# EAGLE design atmega (EAGLE 8.6.0)
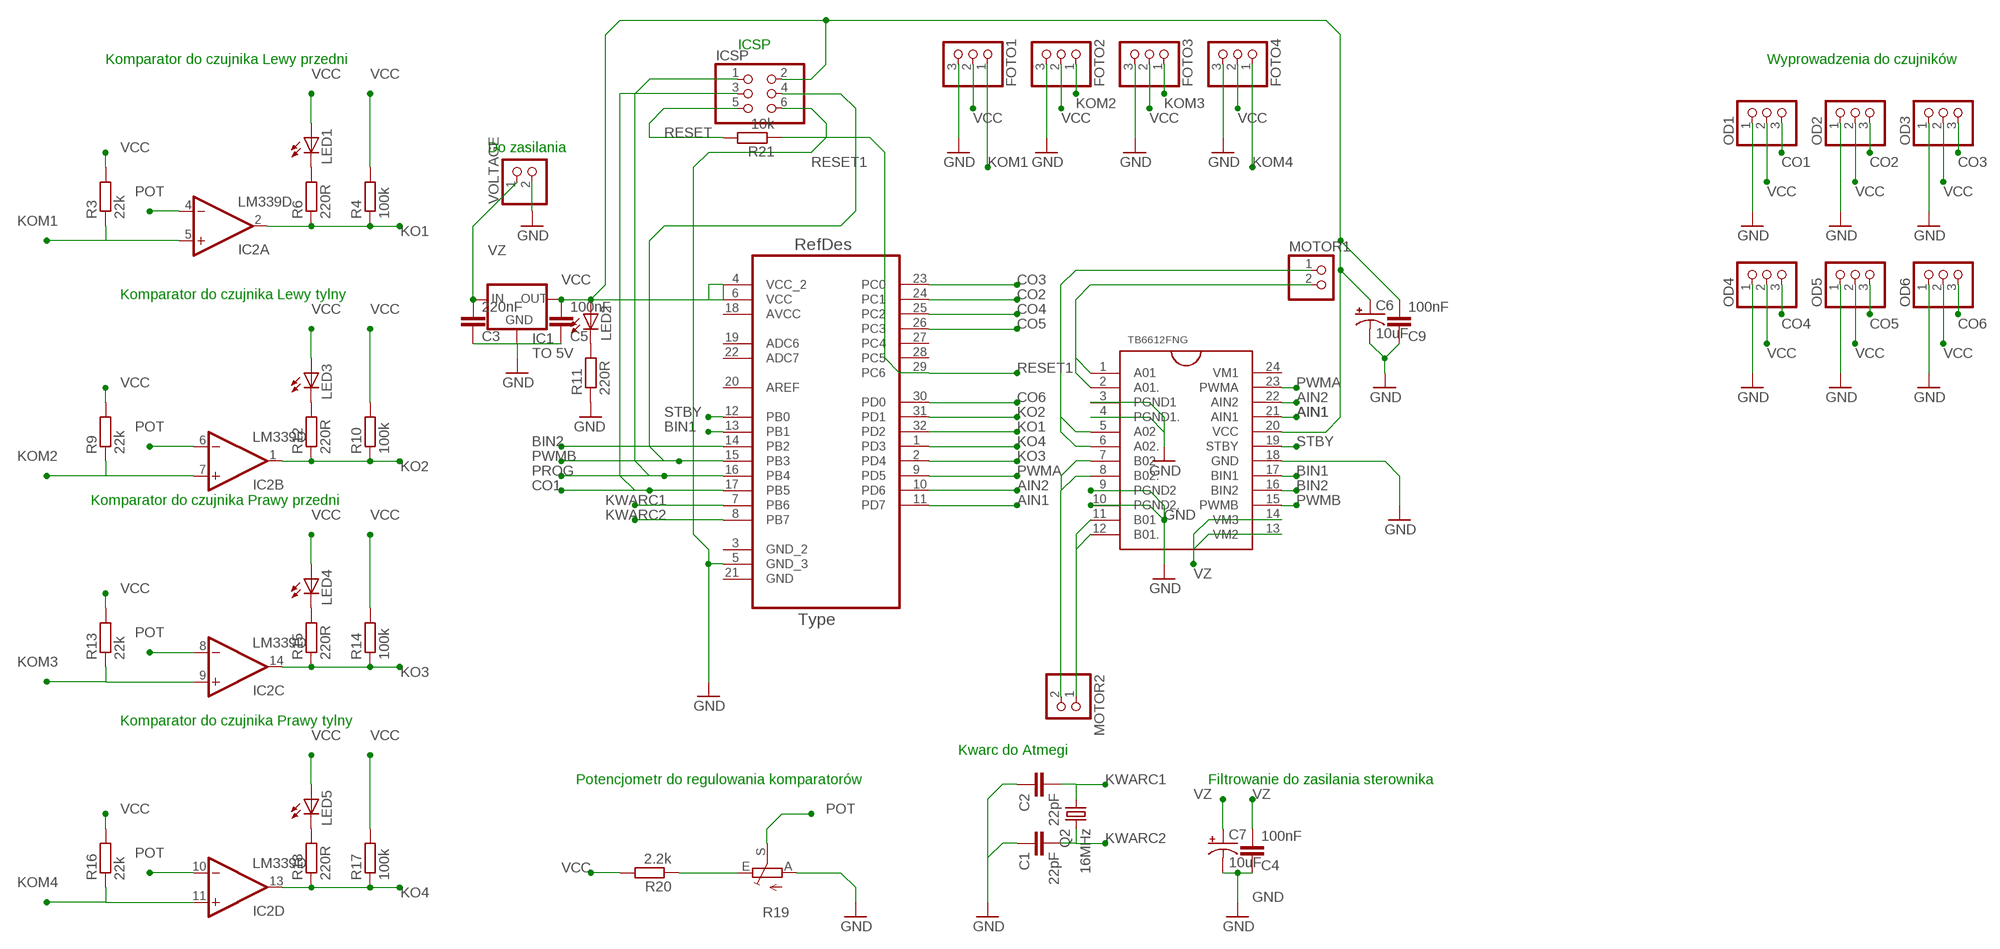
[diagram p0: schematic, sheet 1]

## Parts
C1  22pF  C-EUC0805  [C0805]
C2  22pF  C-EUC0805  [C0805]
C3  220nF  C-EUC0805  [C0805]
C4  100nF  C-EUC0805  [C0805]
C5  100nF  C-EUC0805  [C0805]
C6  10uF  22UF-POLAR-PANASONIC_C-35V-20%  [PANASONIC_C]
C7  10uF  22UF-POLAR-PANASONIC_C-35V-20%  [PANASONIC_C]
C9  100nF  C-EUC0805  [C0805]
FOTO1  PINHD-1X3  [1X03]
FOTO2  PINHD-1X3  [1X03]
FOTO3  PINHD-1X3  [1X03]
FOTO4  PINHD-1X3  [1X03]
IC1  TO 5V  LM1117T-5.0-V  [TO220V]
IC2  LM339D  [SO14]
ICSP  PINHD-2X3  [2X03]
LED1  LEDCHIPLED_0805  [CHIPLED_0805]
LED2  LEDCHIPLED_0805  [CHIPLED_0805]
LED3  LEDCHIPLED_0805  [CHIPLED_0805]
LED4  LEDCHIPLED_0805  [CHIPLED_0805]
LED5  LEDCHIPLED_0805  [CHIPLED_0805]
MOTOR1  PINHD-1X2  [1X02]
MOTOR2  PINHD-1X2  [1X02]
OD1  PINHD-1X3  [1X03]
OD2  PINHD-1X3  [1X03]
OD3  PINHD-1X3  [1X03]
OD4  PINHD-1X3  [1X03]
OD5  PINHD-1X3  [1X03]
OD6  PINHD-1X3  [1X03]
Q2  16MHz  CSM-7X-DU  [CSM-7X-DU]
R3  22k  R-EU_M0805  [M0805]
R4  100k  R-EU_M0805  [M0805]
R6  220R  R-EU_M0805  [M0805]
R9  22k  R-EU_M0805  [M0805]
R10  100k  R-EU_M0805  [M0805]
R11  220R  R-EU_M0805  [M0805]
R12  220R  R-EU_M0805  [M0805]
R13  22k  R-EU_M0805  [M0805]
R14  100k  R-EU_M0805  [M0805]
R15  220R  R-EU_M0805  [M0805]
R16  22k  R-EU_M0805  [M0805]
R17  100k  R-EU_M0805  [M0805]
R18  220R  R-EU_M0805  [M0805]
R19  TRIM_EU-B25P  [B25P]
R20  2.2k  R-EU_M0805  [M0805]
R21  10k  R-EU_M0805  [M0805]
U1  ATMEGA328P-AU  [QFP80P900X900X120-32N]
U$1  TB6612FNG  [SSOP24]
VOLTAGE  PINHD-1X2  [1X02]

## Nets
AIN1: U1.11(PD7) U$1.21(AIN1)
AIN2: U1.10(PD6) U$1.22(AIN2)
BIN1: U1.13(PB1) U$1.17(BIN1)
BIN2: U1.14(PB2) U$1.16(BIN2)
CO1: ICSP.3 OD1.3 U1.17(PB5)
CO2: OD2.3 U1.24(PC1)
CO3: OD3.3 U1.23(PC0)
CO4: OD4.3 U1.25(PC2)
CO5: OD5.3 U1.26(PC3)
CO6: OD6.3 U1.30(PD0)
GND: C1.1 C2.1 C3.1 C4.1 C5.1 C6.- C7.- C9.1 FOTO1.3 FOTO2.3 FOTO3.3 FOTO4.3 IC1.1(GND) ICSP.6 OD1.1 OD2.1 OD3.1 OD4.1 OD5.1 OD6.1 R11.1 R19.A U1.5(GND_3) U$1.3(PGND1) U$1.4(PGND1.) U$1.9(PGND2) U$1.10(PGND2.) U$1.18(GND) VOLTAGE.2
KO1: IC2.2(A:OUT) R4.1 R6.1 U1.32(PD2)
KO2: IC2.1(B:OUT) R10.1 R12.1 U1.31(PD1)
KO3: IC2.14(C:OUT) R14.1 R15.1 U1.2(PD4)
KO4: IC2.13(D:OUT) R17.1 R18.1 U1.1(PD3)
KOM1: FOTO1.1 IC2.5(A:+IN) R3.1
KOM2: FOTO2.1 IC2.7(B:+IN) R9.1
KOM3: FOTO3.1 IC2.9(C:+IN) R13.1
KOM4: FOTO4.1 IC2.11(D:+IN) R16.1
KWARC1: C2.2 Q2.1 U1.7(PB6)
KWARC2: C1.2 Q2.2 U1.8(PB7)
N$2: LED3.C R12.2
N$6: R19.E R20.1
N$7: LED2.C R11.2
N$20: LED1.C R6.2
N$21: LED4.C R15.2
N$29: LED5.C R18.2
OUTMA1: MOTOR1.2 U$1.1(A01) U$1.2(A01.)
OUTMA2: MOTOR1.1 U$1.5(A02) U$1.6(A02.)
OUTMB1: MOTOR2.1 U$1.11(B01) U$1.12(B01.)
OUTMB2: MOTOR2.2 U$1.7(B02) U$1.8(B02.)
POT: IC2.4(A:-IN) IC2.6(B:-IN) IC2.8(C:-IN) IC2.10(D:-IN) R19.S
PROG: ICSP.1 U1.16(PB4)
PWMA: U1.9(PD5) U$1.23(PWMA)
PWMB: ICSP.4 U1.15(PB3) U$1.15(PWMB)
RESET: ICSP.5 R21.2
RESET1: R21.1 U1.29(PC6)
STBY: U1.12(PB0) U$1.19(STBY)
VCC: C5.2 C6.+ C9.2 FOTO1.2 FOTO2.2 FOTO3.2 FOTO4.2 IC1.2(OUT) ICSP.2 LED1.A LED2.A LED3.A LED4.A LED5.A OD1.2 OD2.2 OD3.2 OD4.2 OD5.2 OD6.2 R3.2 R4.2 R9.2 R10.2 R13.2 R14.2 R16.2 R17.2 R20.2 U1.4(VCC_2) U1.6(VCC) U$1.20(VCC)
VZ: C3.2 C4.2 C7.+ IC1.3(IN) U$1.13(VM2) U$1.14(VM3) VOLTAGE.1
Unconnected: U1.3(GND_2) U1.19(ADC6) U1.20(AREF) U1.21(GND) U1.22(ADC7) U1.27(PC4) U1.28(PC5) U$1.24(VM1)

## Notes on the sheet
- ICSP
- Komparator do czujnika Lewy przedni | Wyprowadzenia do czujników
- Do zasilania
- Komparator do czujnika Lewy tylny
- Komparator do czujnika Prawy przedni
- Komparator do czujnika Prawy tylny
- Kwarc do Atmegi
- Potencjometr do regulowania komparatorów | Filtrowanie do zasilania sterownika

## Power pins joined to a net without a drawn wire
AVCC: U1.18(AVCC)
GND: IC2.12(P:GND)
VCC: IC2.3(P:V+)

## Library data of the parts
C1-C5 C9 = rcl:C-EU: CAPACITOR, European symbol; SPICEPREFIX: C
C6 C7 = SparkFun-Capacitors:22UF-POLAR: 22µF polarized capacitors A capacitor is a passive two-terminal electrical component used to store electrical energy temporarily in an electric field.; PROD_ID: CAP-08618; VALUE: 22uF
FOTO1-FOTO4 OD1-OD6 = pinhead:PINHD-1X3: PIN HEADER
IC1 = lm1117:LM1117T-*
IC2 = linear:LM339: Low Power Low Offset Voltage Quad Comparators with open collector; LM139/LM239/LM339/LM2901/LM3302
ICSP = pinhead:PINHD-2X3: PIN HEADER
LED1-LED5 = led:LED: LED OSRAM: - CHIPLED LG R971, LG N971, LY N971, LG Q971, LY Q971, LO R971, LY R971 LH N974, LH R974 LS Q976, LO Q976, LY Q976 LO Q996 - Hyper CHIPLED LW Q18S LB Q993, LB Q99A, LB R99A - SideLED LS A670, LO A670, LY A670, LG A670, LP A670 LB A673, LV A673, LT A673, LW A673 LH A674 LY A675 LS A676, LA A676, LO A676, LY A676, LW A676 LS A679, LY A679, LG A679 - Hyper Micro SIDELED® LS Y876, LA Y876, LO Y876, LY Y876 LT Y87S - SmartLED LW L88C, LW L88S LB L89C, LB L89S, LG L890 LS L89K, LO L89K, LY L89K LS L896, LA L896, LO L896, LY L896 - TOPLED LS T670, LO T670, LY T670, LG T670, LP T670 LSG T670, LSP T670, LSY T670, LOP T670, LYG T670 LG T671, LOG T671, LSG T671 LB T673, LV T673, LT T673, LW T673 LH T674 LS T676, LA T676, LO T676, LY T676, LB T676, LH T676, LSB T676, LW T676 LB T67C, LV T67C, LT T67C, LS T67K, LO T67K, LY T67K, LW E67C LS E67B, LA E67B, LO E67B, LY E67B, LB E67C, LV E67C, LT E67C LW T67C LS T679, LY T679, LG T679 LS T770, LO T770, LY T770, LG T770, LP T770 LB T773, LV T773, LT T773, LW T773 LH T774 LS E675, LA E675, LY E675, LS T675 LS T776, LA T776, LO T776, LY T776, LB T776 LHGB T686 LT T68C, LB T68C - Hyper Mini TOPLED® LB M676 - Mini TOPLED Santana® LG M470 LS M47K, LO M47K, LY M47K Source: http://www.osram.convergy.de LUXEON: - LUMILED® LXK2-PW12-R00, LXK2-PW12-S00, LXK2-PW14-U00, LXK2-PW14-V00 LXK2-PM12-R00, LXK2-PM12-S00, LXK2-PM14-U00 LXK2-PE12-Q00, LXK2-PE12-R00, LXK2-PE12-S00, LXK2-PE14-T00, LXK2-PE14-U00 LXK2-PB12-K00, LXK2-PB12-L00, LXK2-PB12-M00, LXK2-PB14-N00, LXK2-PB14-P00, LXK2-PB14-Q00 LXK2-PR12-L00, LXK2-PR12-M00, LXK2-PR14-Q00, LXK2-PR14-R00 LXK2-PD12-Q00, LXK2-PD12-R00, LXK2-PD12-S00 LXK2-PH12-R00, LXK2-PH12-S00 LXK2-PL12-P00, LXK2-PL12-Q00, LXK2-PL12-R00 Source: www.luxeon.com KINGBRIGHT: KA-3528ASYC Source: www.kingbright.com
MOTOR1 MOTOR2 VOLTAGE = pinhead:PINHD-1X2: PIN HEADER
Q2 = crystal:CSM-7X-DU: SMD CRYSTAL Source: www.ecsxtal.com .. Crystal 3.6864MHz CSM_7X_DU.PDF; OC_FARNELL: unknown; OC_NEWARK: unknown
R3 R4 R6 R9-R18 R20 R21 = resistor:R-EU_: RESISTOR, European symbol
R19 = pot:TRIM_EU-: POTENTIOMETER
U1 = Atmel-ATMEGA328P-AU:ATMEGA328P-AU; DESCRIPTION: 8-bit Microcontroller with In-System Programmable Flash; MPN: ATMEGA328P-AU; OC_FARNELL: 1715486; OC_NEWARK: 14R4631; PACKAGE: TQFP-32; SUPPLIER: Atmel
U$1 = TB6612FNG:TB6612FNG

## Board
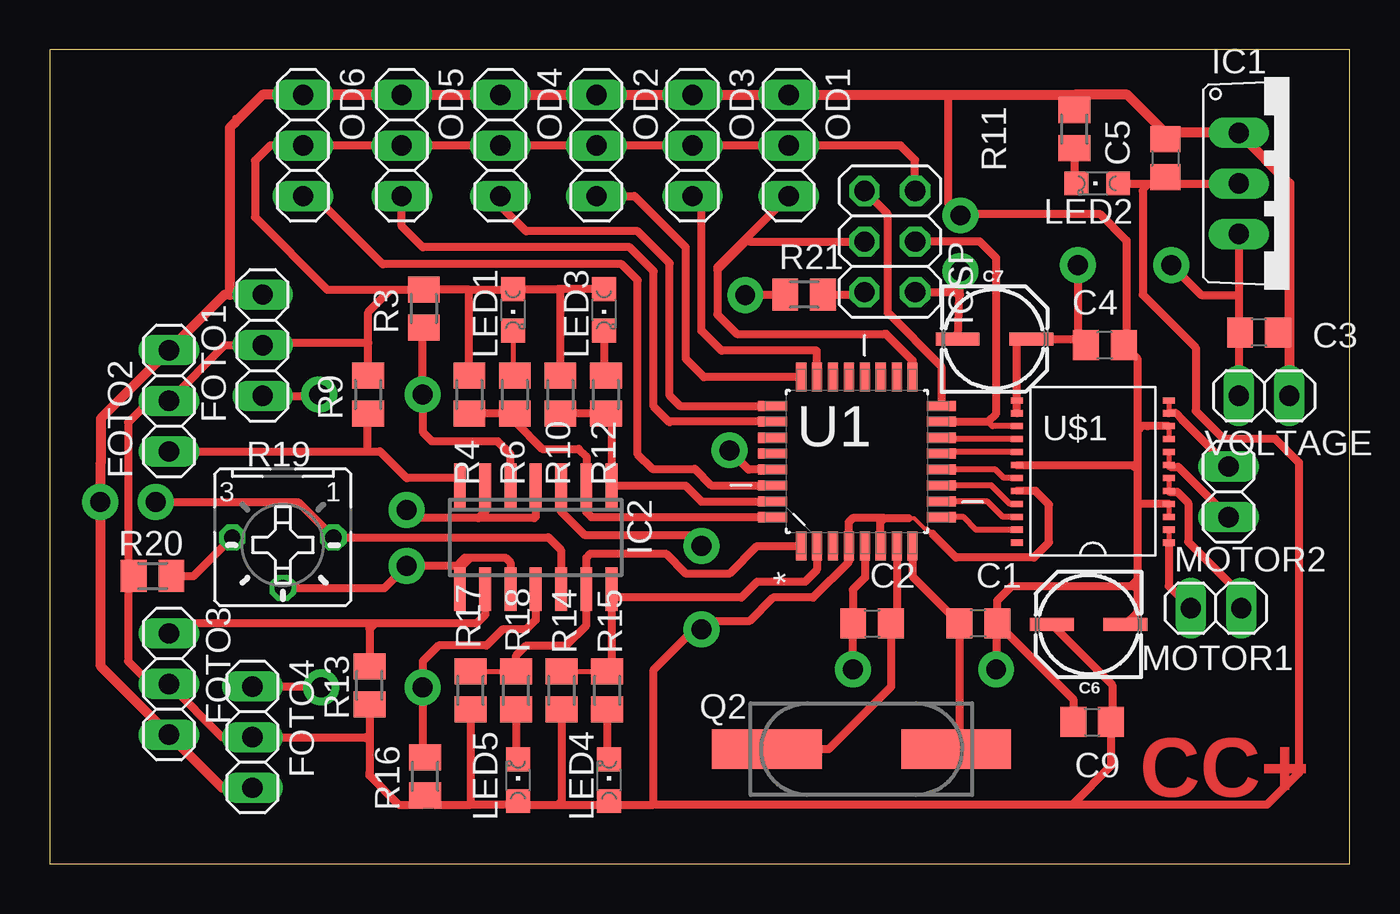
[diagram p1: board, top side]
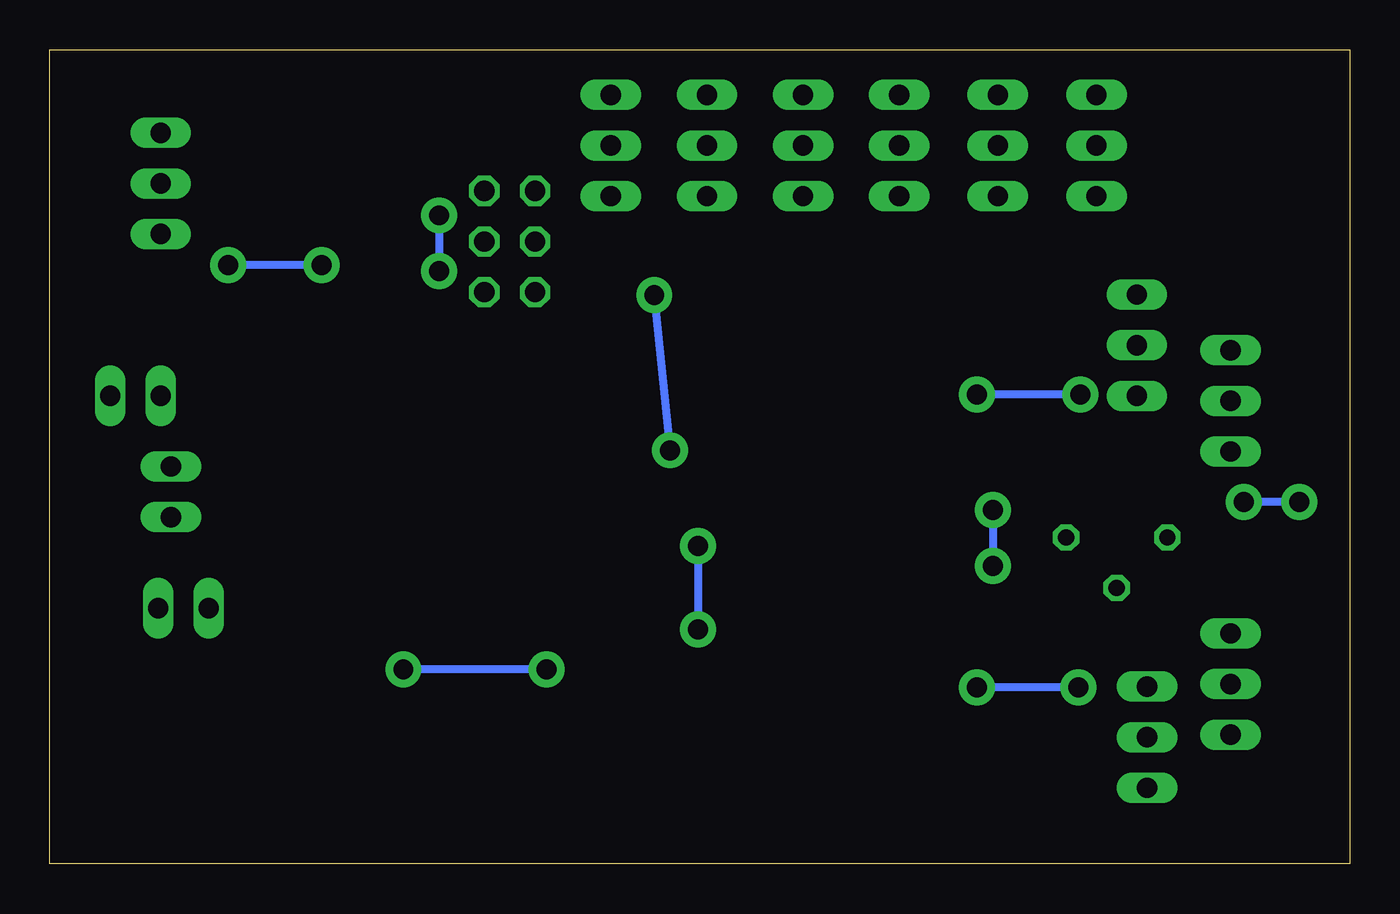
[diagram p2: board, bottom side, seen from below]

Size 65.28 x 40.9 mm. Coordinates in mm from the lower left corner, seen from the top.
Outline: 0,0 65.28,0 65.28,40.9 0,40.9 0,0
Copper layers (1*16): Top 0.035mm / dielectric 1.5mm / Bottom 0.035mm
Design rules "default *": minimum track width 6mil, minimum drill 0.35mm, track to track 8mil, track to pad 8mil, pad to pad 8mil, via to via 8mil, smd to smd 8mil, copper to edge 40mil, drill to drill 8mil, minimum pad ring 10mil, minimum via ring 8mil, stop-mask expansion 4mil, vias tented up to drill 0mil, thermal gap 10mil

### Footprints (pad centres in the part's own frame; a part is rotated, then mirrored left to right if it is on the bottom)
C0805 = smd 1.3 x 1.5: 1 -0.95,0; 2 0.95,0
PANASONIC_C = smd 2.2 x 0.65: + 1.9,-0.2; - -1.8,-0.2
1X03 = drill 1.016 long: 1 -2.54,0; 2 0,0; 3 2.54,0
TO220V = drill 1.016 long: 1 -2.54,-2.54; 2 0,-2.54; 3 2.54,-2.54
SO14 = smd 0.6 x 2.2: 1 -3.81,-2.6; 2 -2.54,-2.6; 3 -1.27,-2.6; 4 0,-2.6; 5 1.27,-2.6; 6 2.54,-2.6; 7 3.81,-2.6; 8 3.81,2.6; 9 2.54,2.6; 10 1.27,2.6; 11 0,2.6; 12 -1.27,2.6; 13 -2.54,2.6; 14 -3.81,2.6
2X03 = drill 1.016 octagon: 1 -2.54,-1.27; 2 -2.54,1.27; 3 0,-1.27; 4 0,1.27; 5 2.54,-1.27; 6 2.54,1.27
CHIPLED_0805 = smd 1.2 x 1.2: A 0,-1.05; C 0,1.05
1X02 = drill 1.016 long: 1 -1.27,0; 2 1.27,0
CSM-7X-DU = smd 5.5 x 2: 1 -4.75,0; 2 4.75,0
M0805 = smd 1.3 x 1.6: 1 -0.95,0; 2 0.95,0
B25P = drill 0.813 octagon: A -2.54,0; E 2.54,0; S 0,2.54
QFP80P900X900X120-32N = smd 1.473 x 0.508: 1 -4.242,2.794; 2 -4.242,2.007; 3 -4.242,1.194; 4 -4.242,0.406; 5 -4.242,-0.406; 6 -4.242,-1.194; 7 -4.242,-2.007; 8 -4.242,-2.794; 17 4.242,-2.794; 18 4.242,-2.007; 19 4.242,-1.194; 20 4.242,-0.406; 21 4.242,0.406; 22 4.242,1.194; 23 4.242,2.007; 24 4.242,2.794 | smd 0.508 x 1.473: 9 -2.794,-4.242; 10 -2.007,-4.242; 11 -1.194,-4.242; 12 -0.406,-4.242; 13 0.406,-4.242; 14 1.194,-4.242; 15 2.007,-4.242; 16 2.794,-4.242; 25 2.794,4.242; 26 2.007,4.242; 27 1.194,4.242; 28 0.406,4.242; 29 -0.406,4.242; 30 -1.194,4.242; 31 -2.007,4.242; 32 -2.794,4.242
SSOP24 = smd 0.305 x 0.61: 1 -3.567,-3.72; 2 -2.917,-3.72; 3 -2.268,-3.72; 4 -1.617,-3.72; 5 -0.968,-3.72; 6 -0.318,-3.72; 7 0.333,-3.72; 8 0.983,-3.72; 9 1.633,-3.72; 10 2.283,-3.72; 11 2.933,-3.72; 12 3.583,-3.72; 13 3.583,3.9; 14 2.933,3.9; 15 2.283,3.9; 16 1.633,3.9; 17 0.983,3.9; 18 0.333,3.9; 19 -0.318,3.9; 20 -0.968,3.9; 21 -1.617,3.9; 22 -2.268,3.9; 23 -2.917,3.9; 24 -3.567,3.9

### Placement (x,y rotation side)
C1  46.63,12.09 180 top
C2  41.29,12.09 0 top
C3  60.72,26.69 180 top
C4  52.98,26.06 180 top
C5  56.03,35.45 270 top
C6  52.22,11.83 180 top
C7  47.39,26.56 0 top
C9  52.34,7.13 0 top
FOTO1  10.69,26.06 90 top
FOTO2  5.99,23.26 90 top
FOTO3  5.99,9.04 270 top
FOTO4  10.18,6.37 270 top
IC1  62.25,34.18 270 top
IC2  24.4,16.4 180 top
ICSP  42.18,31.26 270 top
LED1  23.26,27.83 180 top
LED2  52.6,34.18 90 top
LED3  27.83,27.83 180 top
LED4  28.09,4.21 0 top
LED5  23.51,4.21 0 top
MOTOR1  58.57,12.85 180 top
MOTOR2  59.2,18.69 270 top
OD1  37.1,36.09 270 top
OD2  27.45,36.09 270 top
OD3  32.28,36.09 270 top
OD4  22.62,36.09 270 top
OD5  17.67,36.09 270 top
OD6  12.72,36.09 270 top
Q2  40.77,5.77 0 top
R3  18.78,27.9 90 top
R4  21.07,23.58 90 top
R6  23.35,23.58 90 top
R9  15.99,23.58 90 top
R10  25.64,23.58 90 top
R11  51.45,36.91 270 top
R12  27.93,23.58 90 top
R13  16.05,8.97 270 top
R14  25.71,8.72 270 top
R15  27.99,8.72 270 top
R16  18.85,4.4 270 top
R17  21.13,8.72 270 top
R18  23.42,8.72 270 top
R19  11.7,16.4 180 top
R20  5.16,14.47 180 top
R21  37.88,28.6 0 top
U1  40.53,20.21 90 top
U$1  52.47,19.71 90 top
VOLTAGE  60.98,23.52 0 top

### Tracks (layer width: path | path; a pad name or v marks a point on that pad's centre or on a via)
AIN1
  Top 0.152: 45.13,19.02 U1.11
  Top 0.3: U$1.21 48.22,18.09 47.28,19.02 U1.11
AIN2
  Top 0.3: U$1.22 47.86,17.44 47.1,18.21 U1.10
BIN1
  Top 0.3: U$1.17 44.84,20.69 U1.13
BIN2
  Top 0.3: U$1.16 44.84,21.34 U1.14
CO1
  Top 0.254: 41.93,26.63 41.99,26.63 | 34.94,31.26 35.13,31.26
  Top 0.4: 34.94,31.26 33.53,29.85 | 33.53,29.85 33.53,27.6 34.5,26.63 41.93,26.63 | 35.13,31.26 ICSP.3 | OD1.3 33.53,29.97 33.53,29.85 | 41.99,26.63 43.33,25.29 U1.17
CO2
  Top 0.254: 28.85,33.55 OD2.3
  Top 0.4: U1.24 32.85,24.46 31.93,25.38 31.93,30.98 29.35,33.55 OD2.3
CO3
  Top 0.254: 32.53,33.3 OD3.3
  Top 0.4: U1.23 38.53,25.78 33.73,25.78 32.73,26.78 32.73,33.1 OD3.3
CO4
  Top 0.254: 35.93,23.01 U1.25
  Top 0.4: OD4.3 22.62,33.08 23.93,31.78 29.53,31.78 31.13,30.18 31.13,23.52 31.64,23.01 35.93,23.01
CO5
  Top 0.254: OD5.3 17.55,33.42 17.67,33.3
  Top 0.4: U1.26 31.16,22.22 31.16,22.21 31.13,22.18 30.33,22.98 30.33,29.78 29.13,30.98 18.73,30.98 17.67,32.03 OD5.3
CO6
  Top 0.254: 35.93,19.02 U1.30
  Top 0.4: OD6.3 13.3,33.55 16.73,30.12 28.72,30.12 29.53,29.32 29.53,20.58 30.26,19.84 32.39,19.84 33.22,19.02 35.93,19.02
GND  (via drill 1 pad 1.8)
  Top 0.152: U$1.10 55.78,21.99 | U$1.4 55.61,18.09 55.52,18.18 55.52,18.06
  Top 0.254: C1.1 48.08,12.27 | 51.58,37.86 R11.1 | 9.29,37.49 9.29,37.23 | 48.99,20.04 U$1.18 49.25,20.04 | 55.52,18.06 56.16,18.06 U$1.4 U$1.3 | U$1.9 U$1.10 55.52,21.99 | 55.52,21.99 | 54.63,19.78 54.63,18.18 | 54.63,16.98 54.63,18.18 | 54.72,18.09 54.63,18.18 | 54.76,21.99 55.13,21.99 55.52,21.99 | C4.1 54.07,25.92
  Top 0.4: U$1.4 54.72,18.09 | U$1.10 55.13,21.99 54.84,21.99 | 54.84,21.99 54.76,21.99 | 54.63,14.18 54.63,14.28 | 54.63,14.28 54.63,16.98 54.63,19.78 | 54.63,19.78 54.63,20.18 | 54.63,20.18 54.63,21.78 | 54.63,21.78 54.63,25.36 54.07,25.92 54.07,31.32 52.73,32.66 45.64,32.66 | U$1.18 54.37,20.04 | 54.37,20.04 54.63,19.78 | 54.37,20.04 54.49,20.04 54.63,20.18 | C1.1 51.39,8.27 C9.1 | 54.62,14.18 54.63,14.18 | C6.- 54.63,12.65 54.63,13.78 | 54.63,13.78 54.63,14.18 | IC2.12 25.67,15.77 25.04,16.4 R19.A 12.47,18.18 v5.33,18.18 | 45.48,28.72 45.61,28.6 | C7.- 45.61,26.39 45.69,28.57 | 54.33,13.98 48.33,13.98 47.58,13.23 C1.1 | 54.33,13.98 54.43,13.98 54.63,13.78 | 54.33,13.98 54.63,14.28 | v2.53,18.18 2.53,20.15 2.56,20.18 | v45.73,29.78 45.71,29.37 45.71,28.6 45.69,28.57 | ICSP.6 45.48,28.72 | 45.13,38.63 45.13,33.18 45.64,32.66 | 54.84,21.99 54.63,21.78 | 45.48,28.72 45.53,28.72 45.69,28.57 | v45.73,32.58 45.64,32.66 | U1.5 40.94,14.39 40.33,13.78 40.33,12.1 C2.1 40.34,10.2 | 40.33,10.18 40.34,10.2 | C1.1 47.53,12.03 v47.53,9.78 | 40.34,10.2 40.34,9.8 v40.33,9.78
  Top 0.508: 51.58,37.86 51.19,38.25 51.07,38.25 R11.1 51.45,38.63 | OD5.1 10.69,38.63 9.29,37.23 9.04,36.98 9.04,28.6 | FOTO1.3 9.04,28.6 | 9.04,28.6 8.78,28.6 FOTO2.3 2.56,22.37 2.56,20.18 2.56,9.93 FOTO3.3 8.66,3.83 FOTO4.3 | OD6.1 OD5.1 | OD5.1 OD4.1 OD3.1 | OD3.1 OD1.1 45.13,38.63 51.45,38.63 | OD2.1 OD3.1 | 62.25,26.12 62.25,34.18 IC1.1 56.5,36.72 56.19,36.42 C5.1 56.03,36.72 54.12,38.63 51.45,38.63 | C3.1 62.25,26.12 | 62.25,26.12 VOLTAGE.2
  Bottom 0.4: v2.53,18.18 v5.33,18.18 | v45.73,32.58 v45.73,29.78 | v40.33,9.78 v47.53,9.78
KO1
  Top 0.152: 36.13,17.42 U1.32
  Top 0.254: 21.13,22.63 R4.1
  Top 0.4: 36.13,17.42 27.2,17.42 26.94,17.67 IC2.2 26.94,20.47 26.56,20.85 24.73,20.85 23.35,22.22 R6.1 21.13,22.63
KO2
  Top 0.152: 36.13,18.21 U1.31
  Top 0.254: 28.21,19.38 IC2.1 | 35.93,18.21 36.13,18.21
  Top 0.4: IC2.1 31.93,19 32.73,18.21 35.93,18.21 | R10.1 R12.1 28.21,22.35 28.21,19.38
KO3
  Top 0.152: 28.22,9.93 28.15,9.86 27.96,9.67 | 28.21,14.25 IC2.14
  Top 0.254: R14.1 27.96,9.67 R15.1 | IC2.14 28.21,13.61 | 28.21,13.61 28.21,13.38 28.21,9.92 28.15,9.86 | U1.2 38.53,14.91 | 28.34,13.74 28.21,13.61
  Top 0.4: U1.2 38.53,14.78 37.93,14.18 35.53,14.18 34.73,13.38 28.21,13.38 | IC2.14 28.21,9.92 27.96,9.67
KO4
  Top 0.254: R17.1 R18.1
  Top 0.4: R18.1 23.42,10.47 23.93,10.98 25.93,10.98 26.94,12 IC2.13 26.94,15.38 27.15,15.59 30.94,15.59 31.92,14.6 34.16,14.6 35.53,15.97 U1.1
KOM1  (via drill 1 pad 1.8)
  Top 0.254: 23.13,19.38 IC2.5
  Top 0.4: 23.13,19.38 23.13,20.6 22.5,21.23 19.2,21.23 18.73,21.7 v18.73,23.58 18.73,26.89 R3.1 | v13.53,23.58 13.46,23.52 FOTO1.1
  Bottom 0.4: v13.53,23.58 v18.73,23.58
KOM2
  Top 0.254: 15.89,22.54 R9.1
  Top 0.4: FOTO2.1 15.93,20.72 | 15.93,20.72 16.58,20.72 17.93,19.38 20.59,19.38 IC2.7 | R9.1 15.93,22.57 15.93,20.72
KOM3
  Top 0.254: 6.42,12.01 FOTO3.1 | 16.78,12.09 16.33,12.09
  Top 0.4: IC2.9 21.86,12.52 21.43,12.09 16.33,12.09 | 16.33,12.09 16.05,11.81 R13.1 | 16.33,12.09 6.5,12.09 FOTO3.1
KOM4  (via drill 1 pad 1.8)
  Top 0.4: IC2.11 24.4,12.26 23.93,11.78 22.73,11.78 21.93,10.98 19.53,10.98 18.73,10.18 v18.73,8.88 18.73,5.47 R16.1 | FOTO4.1 13.59,8.91 v13.63,8.88
  Bottom 0.4: v13.63,8.88 v18.73,8.88
KWARC1
  Top 0.254: 42.54,12.82 42.48,12.68 C2.2
  Top 0.4: U1.7 42.54,12.74 42.48,12.68 | C2.2 42.24,8.9 39.12,5.77 Q2.1
KWARC2
  Top 0.4: Q2.2 45.68,5.93 C1.2 43.33,14.44 U1.8
N$2
  Top 0.4: LED3.C 27.83,24.63 R12.2
N$6
  Top 0.254: 9.13,16.37 R19.E
  Top 0.4: R20.1 7.23,14.47 R19.E
N$7
  Top 0.254: LED2.C
  Top 0.4: R11.2 51.45,34.28 LED2.C
N$20
  Top 0.254: LED1.C 23.26,24.63 R6.2
N$21
  Top 0.4: R15.2 27.99,5.36 LED4.C
N$29
  Top 0.4: R18.2 23.42,5.36 LED5.C
OUTMA1
  Top 0.254: U$1.2 U$1.1 | 57.15,13 MOTOR1.2
  Top 0.4: U$1.1 56.19,13.95 57.15,13
OUTMA2
  Top 0.254: U$1.6 U$1.5
  Top 0.4: MOTOR1.1 59.84,13.51 57.17,16.18 57.17,18.14 56.61,18.69 56.24,18.69 U$1.5
OUTMB1
  Top 0.254: U$1.12 U$1.11
  Top 0.4: MOTOR2.1 56.9,22.26 56.9,22.31 56.57,22.64 U$1.11
OUTMB2
  Top 0.254: U$1.8 U$1.7
  Top 0.4: U$1.7 56.28,19.94 56.66,19.94 MOTOR2.2
POT  (via drill 1 pad 1.8)
  Top 0.152: 23.13,15.13 23.13,14.63
  Top 0.254: IC2.10 23.13,14.58
  Top 0.4: IC2.8 20.59,15.13 20.85,15.39 21.13,15.39 | 21.13,15.39 22.88,15.39 23.13,15.13 23.13,14.58 | 21.53,17.38 21.93,17.78 21.93,18.94 IC2.6 | IC2.4 24.4,17.46 24.33,17.38 21.53,17.38 | R19.S 16.81,13.86 v17.93,14.98 20.72,14.98 21.13,15.39 | 21.53,17.38 18.33,17.38 v17.93,17.78
  Bottom 0.4: v17.93,17.78 v17.93,14.98
PROG
  Top 0.4: U1.16 44.77,24.99 42.08,27.69 42.08,32.64 ICSP.1
PWMA
  Top 0.3: U$1.23 46.52,16.79 45.88,17.42 U1.9
PWMB
  Top 0.3: U$1.15 47.34,21.99 47.11,22.22
  Top 0.4: ICSP.4 46.7,31.26 47.53,30.44 47.53,22.64 47.11,22.22 U1.15
RESET
  Top 0.4: R21.2 40.79,28.6 ICSP.5
RESET1  (via drill 1 pad 1.8)
  Top 0.4: v34.13,20.78 35.1,19.81 U1.29 | R21.1 36.52,28.58 v34.93,28.58
  Bottom 0.4: v34.93,28.58 v34.13,20.78
STBY
  Top 0.3: U$1.19 47.91,19.39 47.5,19.81 U1.12
VCC  (via drill 1 pad 1.8)
  Top 0.152: 40.02,16.53 40.02,16 40.13,15.9 U1.4 | 41.67,16.18 41.67,16.02 U1.6 | v32.73,15.98 32.73,16.08 32.78,16.02
  Top 0.2: 44.33,16.58 44.04,16.86 43.91,16.86 43.4,17.38 43.13,17.38
  Top 0.254: R3.2 19.07,29.14 19.45,29.14 19.42,29.1 | R4.2 20.97,24.63 | R9.2 16.15,24.88 | 23.23,3.45 LED5.A | 16.05,4.43 16.05,4.58 | FOTO3.2 7.61,7.49 8.78,6.37 FOTO4.2 | OD6.2 OD5.2 OD4.2 OD2.2 27.53,36.09 | 40.11,16.53 40.02,16.53 | U1.6 41.73,16.59 | IC1.2 56.35,34.18 C5.2 55.71,34.18 55.26,34.18 | 53.81,34.34 LED2.A 55.26,34.18 | 55.26,34.18 54.88,33.8 | LED3.A 27.58,29.14 | 23.51,29.14 LED1.A | 53.36,7.2 C9.2
  Top 0.4: C6.+ 53.36,8.99 53.36,7.2 | 51.34,2.98 53.29,4.93 C9.2 | 51.34,2.98 61.13,2.98 62.73,4.58 62.73,20.18 61.55,21.36 58.95,21.36 57.55,22.75 57.55,25.93 54.88,28.6 54.88,33.8 | 51.34,2.98 30.33,2.98 | 23.7,2.98 23.33,2.98 | 23.33,2.98 21.13,2.98 | 19.02,3.28 19.32,2.98 21.13,2.98 | R17.2 21.13,2.99 21.13,2.98 | R13.2 16.05,6.18 | 16.05,6.18 16.05,4.58 16.05,4.45 17.53,2.98 18.73,2.98 19.02,3.28 | 16.05,6.18 15.86,6.37 FOTO4.2 8.66,6.37 FOTO3.2 5.07,9.04 3.93,10.18 3.93,13.78 4.21,14.06 R20.2 3.93,14.75 3.93,22.18 5.01,23.26 FOTO2.2 8.78,26.06 FOTO1.2 10.81,26.18 15.99,26.18 | IC2.3 25.67,17.71 26.85,16.53 32.28,16.53 32.78,16.02 | 30.33,2.98 30.33,9.75 32.35,11.78 v32.73,11.78 33.16,12.21 35.16,12.21 36.33,13.38 38.33,13.38 40.13,15.18 U1.4 40.13,17.18 40.33,17.38 41.93,17.38 | 18.82,28.88 R3.2 | R4.2 21.07,28.83 21.04,28.85 | R10.2 25.64,28.77 25.53,28.88 | 17.13,28.85 13.94,28.85 10.31,32.48 10.31,35.33 11.07,36.09 OD6.2 OD4.2 27.53,36.09 OD3.2 OD1.2 42.73,36.09 43.45,35.36 ICSP.2 | R9.2 15.99,26.18 | 15.99,26.18 15.99,27.71 17.13,28.85 | U1.6 41.73,17.18 41.93,17.38 | U$1.20 49.5,18.74 50.18,18.06 50.18,16.15 49.42,15.39 45.52,15.39 44.33,16.58 | LED4.A 28.27,2.98 | 28.27,2.98 30.33,2.98 | 23.7,2.98 LED5.A 23.33,2.98 | R16.2 19.02,3.28 | 23.7,2.98 25.53,2.98 | 25.53,2.98 28.27,2.98 | R14.2 25.71,3.16 25.53,2.98 | 17.13,28.85 R3.2 | 25.53,28.88 LED1.A 23.23,28.85 21.04,28.85 | LED2.A IC1.2 | LED3.A 25.53,28.88 | 21.04,28.85 R3.2 | 41.93,17.38 43.13,17.38
  Bottom 0.4: v32.73,15.98 v32.73,11.78
VZ  (via drill 1 pad 1.8)
  Top 0.254: VOLTAGE.1 C3.2 59.71,28.58 59.71,28.72 IC1.3 | U$1.14 48.61,22.68 | 51.58,26.58 51.9,26.26 | 48.57,26.18 48.57,26.41 C7.+
  Top 0.4: IC1.3 VOLTAGE.1 | 48.57,26.18 U$1.13 U$1.14 | 59.71,28.58 57.82,28.58 v56.33,30.08 | 51.63,26.46 | 51.63,26.46 51.72,26.36 | 51.72,26.36 C4.2 52.03,26.13 51.58,26.58 | 51.72,26.36 51.53,26.36 | C7.+ 51.53,26.36 | 51.53,26.36 | 51.53,26.36 51.63,26.46 | v51.63,30.08 51.63,26.46 | 51.63,26.46 51.53,26.36
  Bottom 0.4: v51.63,30.08 v56.33,30.08

### Text on the board
Top: CC+